# Altium schematic sheet esp32_c6_a1_sensors.SchDoc: Sensors
size A3; SheetNumber: 4; SheetTotal: 4
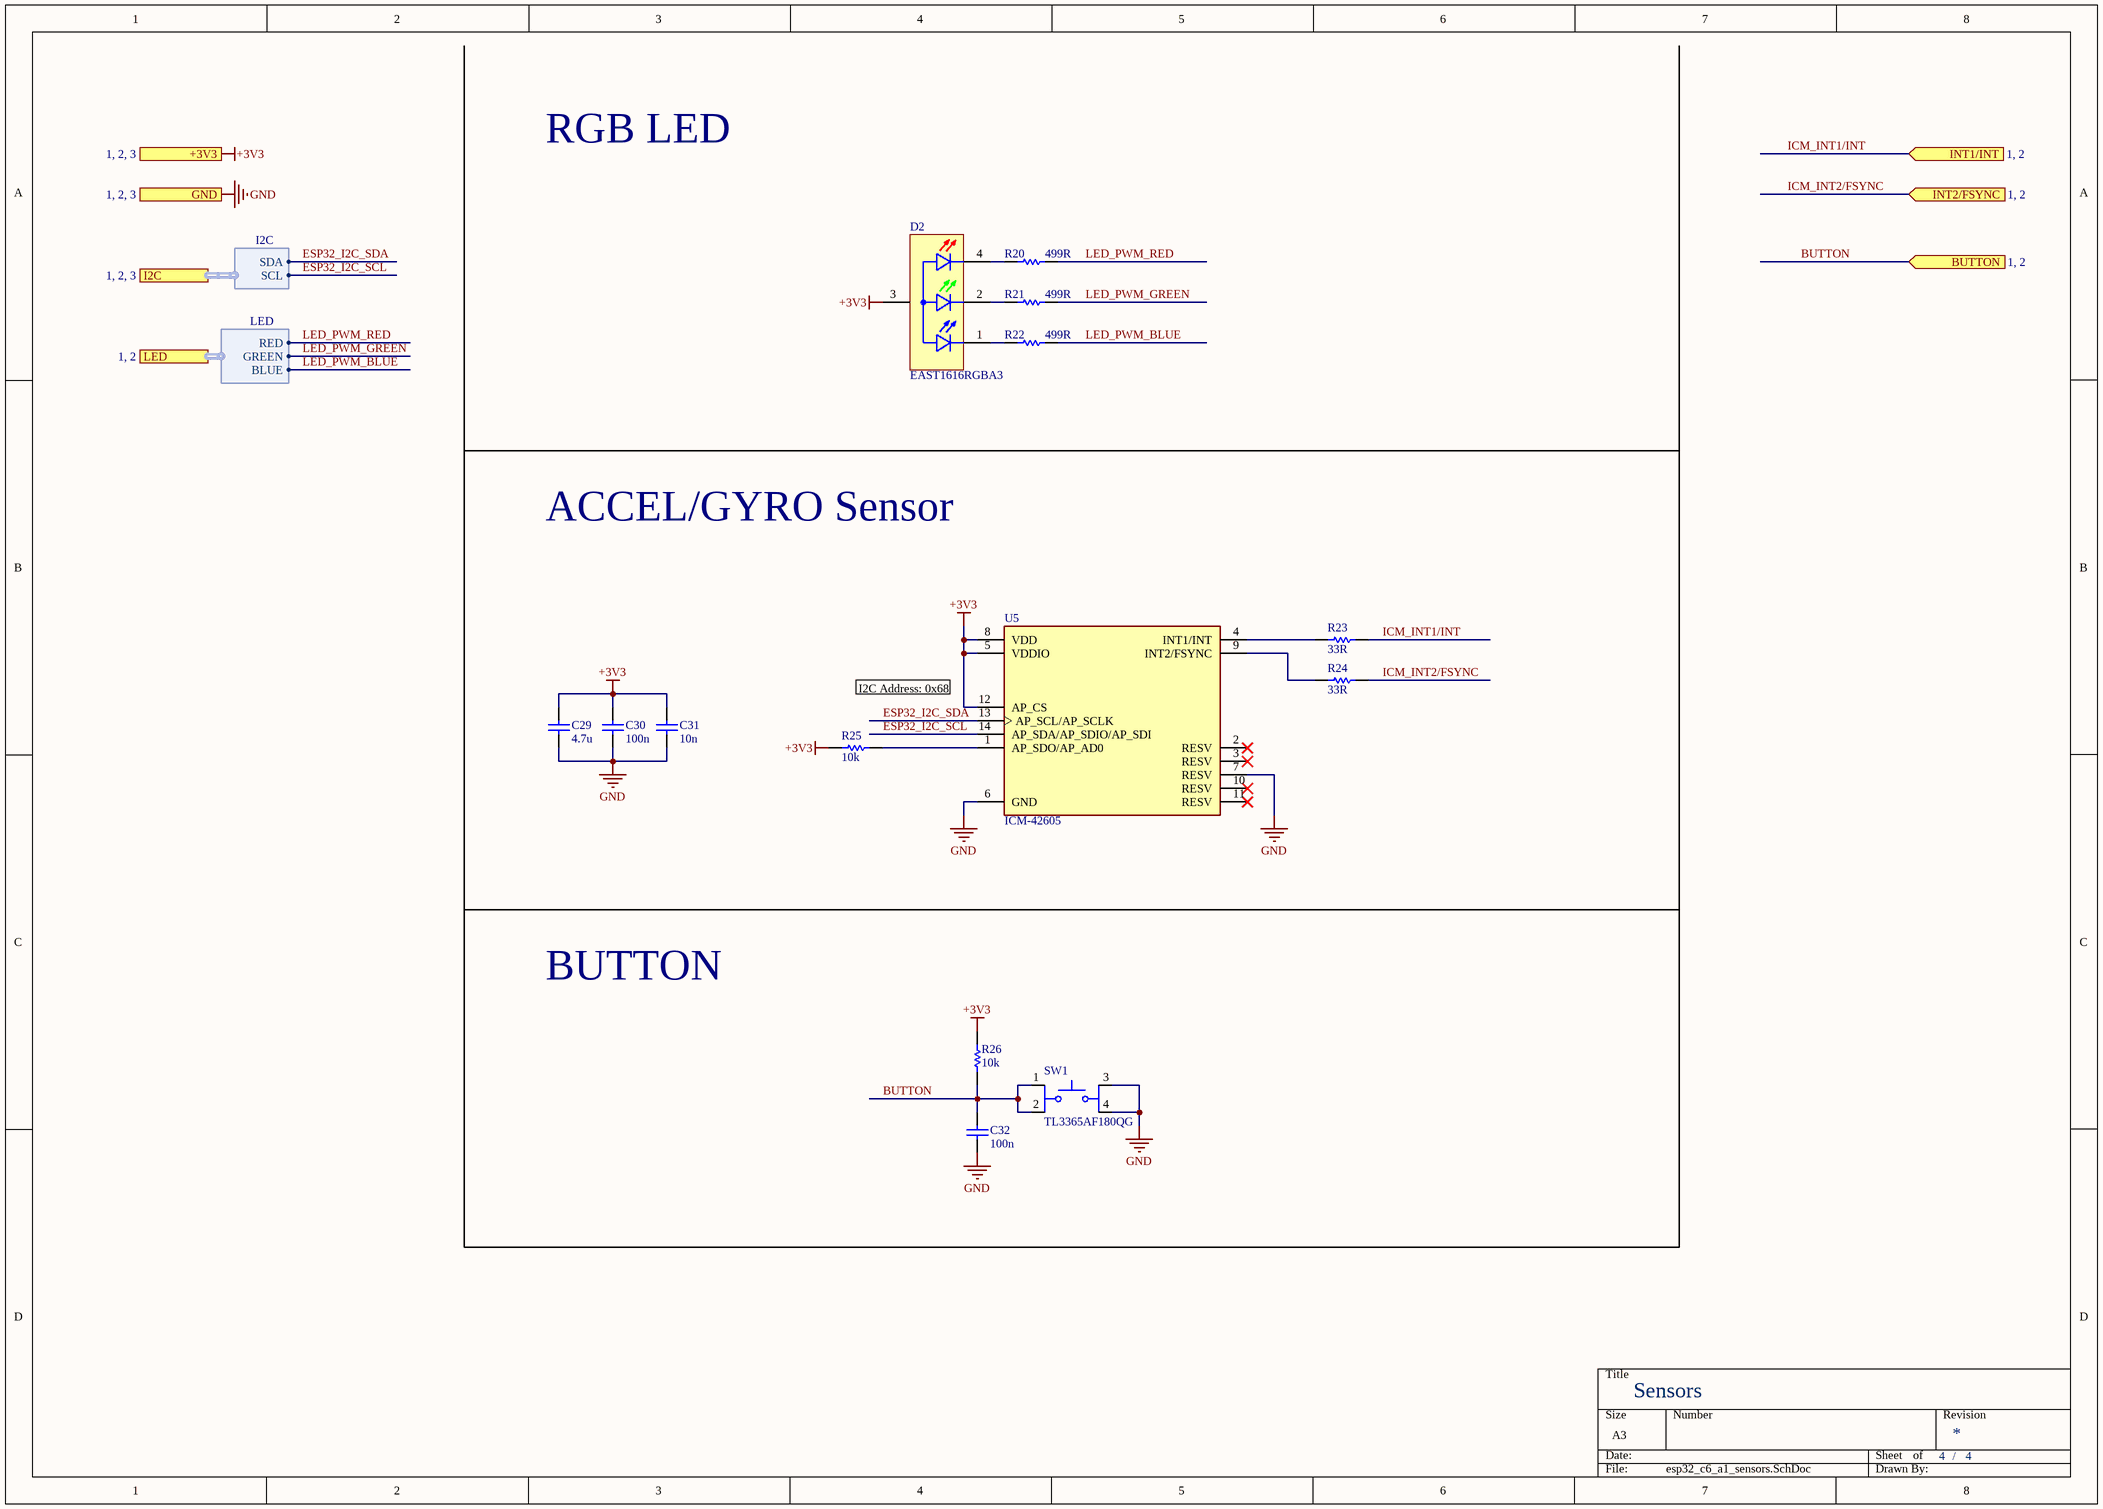
[diagram p0: esp32_c6_a1_sensors.SchDoc]

## Parts
C29  value 4.7u  [C_0603]  (hidden comment: 0603)
C30  value 100n  [C_0402]  (hidden comment: 0402)
C31  value 10n  [C_0402]  (hidden comment: 0402)
C32  value 100n  [C_0402]  (hidden comment: 0402)
D2  EAST1616RGBA3  [LED_EAST1616RGBA3]
R20  value 499R  [R_0402]  (hidden comment: 0402)
R21  value 499R  [R_0402]  (hidden comment: 0402)
R22  value 499R  [R_0402]  (hidden comment: 0402)
R23  value 33R  [R_0402]  (hidden comment: 0402)
R24  value 33R  [R_0402]  (hidden comment: 0402)
R25  value 10k  [R_0402]  (hidden comment: 0402)
R26  value 10k  [R_0402]  (hidden comment: 0402)
SW1  TL3365AF180QG  [SW_TL3365AF180QG]
U5  ICM-42605  [XDCR_ICM-42605]

## Ports
+3V3 (see 1, 2, 3), BUTTON (in, see 1, 2), GND (see 1, 2, 3), I2C (harness I2C, see 1, 2, 3), INT1/INT (in, see 1, 2), INT2/FSYNC (in, see 1, 2), LED (harness LED, see 1, 2)

## Harnesses
I2C: SDA, SCL
LED: RED, GREEN, BLUE

## Nets
+3V3: C29.2 C30.1 C31.1 D2.3(A) R25.2 R26.1 U5.5(VDDIO) U5.8(VDD) U5.12(AP_CS) ; port +3V3
GND: C29.1 C30.2 C31.2 C32.2 SW1.3 SW1.4 U5.6(GND) U5.7(RESV) ; port GND
BUTTON: C32.1 R26.2 SW1.1 SW1.2 ; port BUTTON
ESP32_I2C_SCL: U5.14(AP_SDA/AP_SDIO/AP_SDI) ; port I2C.SCL
ESP32_I2C_SDA: U5.13(AP_SCL/AP_SCLK) ; port I2C.SDA
ICM_INT1/INT: R23.1 ; port INT1/INT
ICM_INT2/FSYNC: R24.1 ; port INT2/FSYNC
LED_PWM_BLUE: R22.2 ; port LED.BLUE
LED_PWM_GREEN: R21.2 ; port LED.GREEN
LED_PWM_RED: R20.2 ; port LED.RED
NetD2_1: D2.1(B_C) R22.1
NetD2_2: D2.2(G_C) R21.1
NetD2_4: D2.4(R_C) R20.1
NetR23_2: R23.2 U5.4(INT1/INT)
NetR24_2: R24.2 U5.9(INT2/FSYNC)
NetR25_1: R25.1 U5.1(AP_SDO/AP_AD0)

Not connected (* = marked no-connect by the designer): U5 2(RESV)* 3(RESV)* 10(RESV)* 11(RESV)*

## Notes on the sheet
- RGB LED
- ACCEL/GYRO Sensor
- I2C Address: 0x68
- BUTTON
- /

## Library data of the parts
C29 = C_0603: SMD 0603 Ceramic Chip Capacitor; Manufacturer: Samsung; MPN: CL10A475KP8NNNC; Cad Data: ?; Part Number: ?; List Code: ?
C30 C32 = C_0402: SMD 0402 Ceramic Chip Capacitor; Manufacturer: Samsung; MPN: CL05B104KP5NNNC; Cad Data: ?; Part Number: ?; List Code: ?
C31 = C_0402: SMD 0402 Ceramic Chip Capacitor; Manufacturer: Samsung; MPN: CL05B103KB5NNNC; Cad Data: ?; Part Number: ?; List Code: ?
D2 = EAST1616RGBA3: Red, Green, Blue (RGB) - LED Indication - Discrete 1.95V Red, 2.8V Green, 2.8V Blue 0606 (1616 Metric); Manufacturer: Everlight Electronics; Check_prices: https://www.snapeda.com/parts/EAST1616RGBA3/Everlight+Electronics+Co+Ltd/view-part/?ref=eda; Value: *; Availability: In Stock; MPN: EAST1616RGBA3; Price: None; Package: 0606 Everlight; SnapEDA_Link: https://www.snapeda.com/parts/EAST1616RGBA3/Everlight+Electronics+Co+Ltd/view-part/?ref=snap; Purchase-URL: https://pricing.snapeda.com/search/part/EAST1616RGBA3/?ref=eda
R20-R22 = R_0402: SMD 0402 Rectangular Thick Film Chip Resistor; Manufacturer: Yageo; MPN: RC0402FR-07499RL; Cad Data: ?; Part Number: ?; List Code: ?
R23 R24 = R_0402: SMD 0402 Rectangular Thick Film Chip Resistor; Manufacturer: Yageo; MPN: RC0402FR-0733RL; Cad Data: ?; Part Number: ?; List Code: ?
R25 R26 = R_0402: SMD 0402 Rectangular Thick Film Chip Resistor; Manufacturer: Yageo; MPN: RC0402FR-0710KL; Cad Data: ?; Part Number: ?; List Code: ?
SW1 = TL3365AF180QG: Tactile Switch SPST-NO Top Actuated Surface Mount; Manufacturer: E-Switch; MPN: TL3365AF180QG; Check_prices: https://www.snapeda.com/parts/TL3365AF180QG/E-Switch/view-part/?ref=eda; Price: None; SnapEDA_Link: https://www.snapeda.com/parts/TL3365AF180QG/E-Switch/view-part/?ref=snap; Package: None; Value: *; Purchase-URL: https://pricing.snapeda.com/search/part/TL3365AF180QG/?ref=eda; Availability: In Stock
U5 = ICM-42605: Manufacturer: TDK Invensense; Description: Accelerometer, Gyroscope, 6 Axis Sensor I2C, I3C, SPI Output; Package: None; Price: None; Value: *; MPN: ICM-42605; Availability: Unavailable